# EasyEDA Pro project Final Main.eprj

# Schematic powermanagmen
Board Name: powermanagmen; Create Date: 2026-01-09; Page Name: powermanagmen; Project Name: Final Main; Schematic Name: powermanagmen; Update Date: 2026-01-09; File: powermanagmen; Id: /; Sheet: /
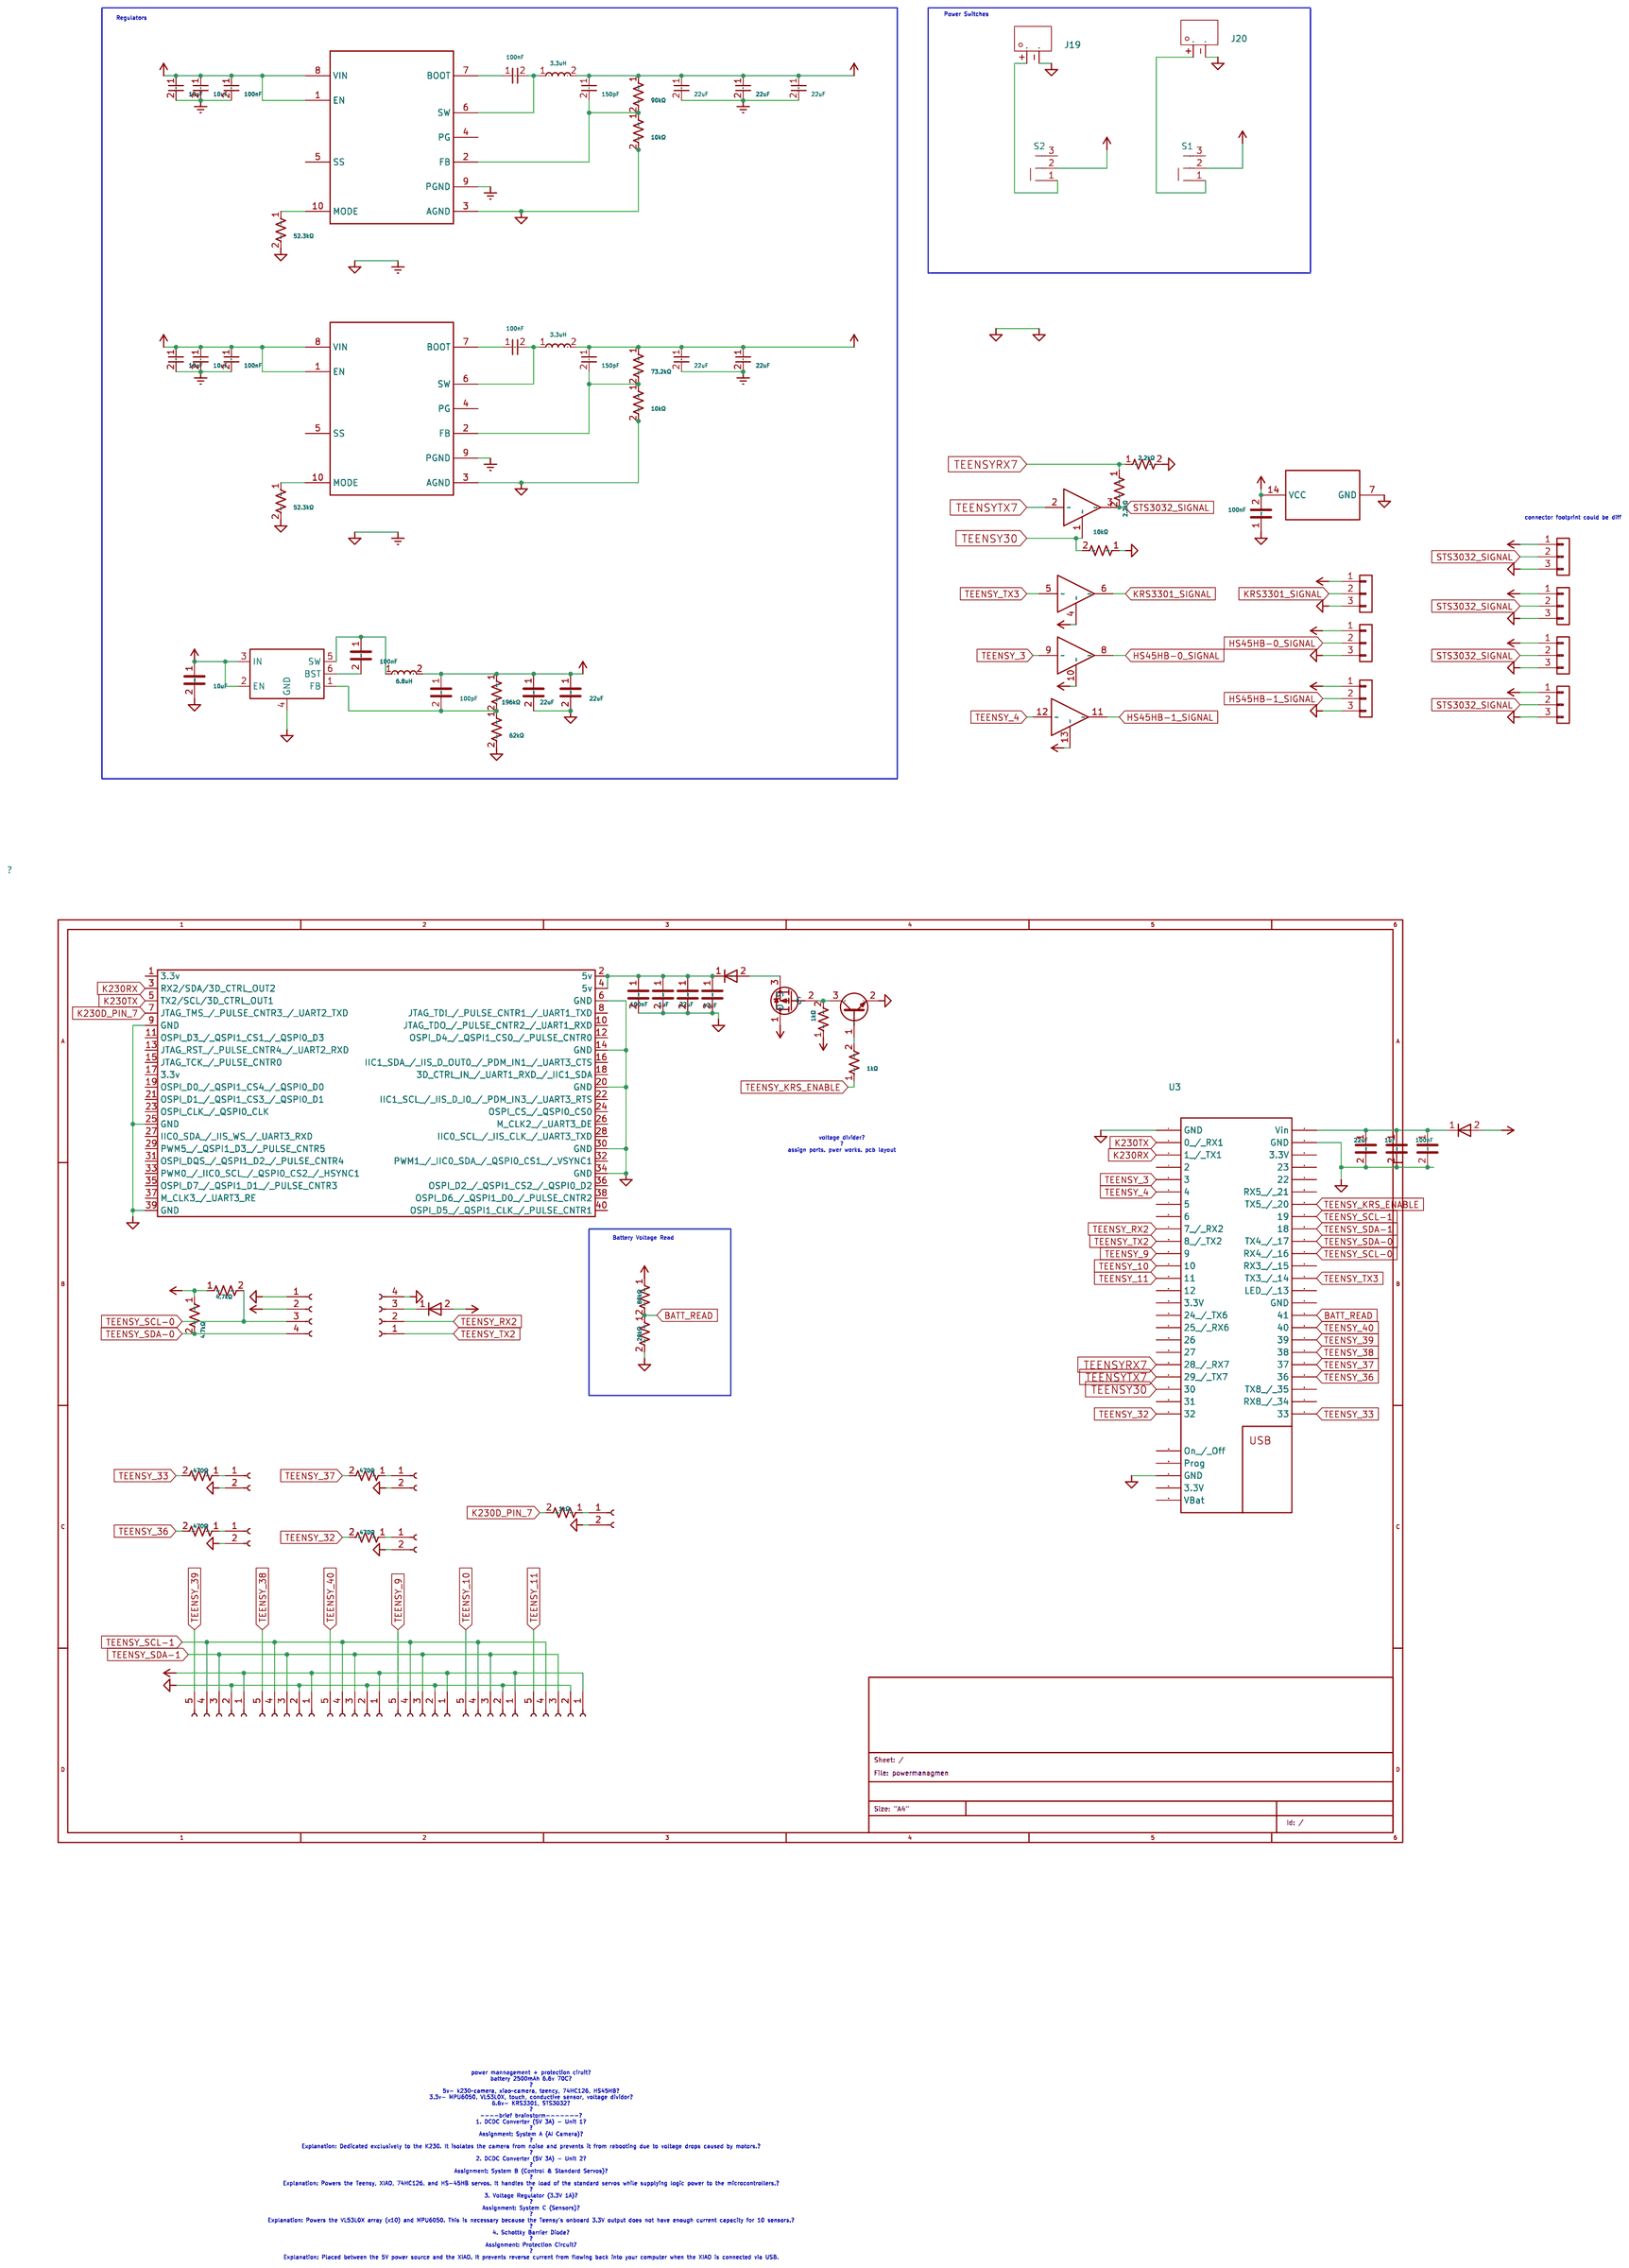
[diagram p0: schematic sheet]

## Parts
C1  100nF  [C0603]
C2  22uF  [C0603]
C3  1uF  [C0603]
C4  100nF  [C0603]
C5  10uF  [C0603]
C6  22uF  [C0603]
C7  22uF  [C0603]
C8  22uF  [C0603]
C10  100pF  [C0603]
C12  150pF  [C0603]
C17  100nF  [C0603]
C18  1uF  [C0603]
C19  22uF  [C0603]
C20  47uF  [C0603]
C21  22uF  [C0603]
C22  10uF  [C0603]
C23  100nF  [C0603]
C24  100nF  [C0603]
C28  100nF  [C0603]
C29  22uF  [C0603]
C31  10uF  [C0603]
C32  100nF  [C0603]
C33  100nF  [C0603]
C34  10uF  [C0603]
C35  10uF  [C0603]
C36  22uF  [C0603]
C37  22uF  [C0603]
C39  150pF  [C0603]
D1  BAT60B  [SOD-323_L1.7-W1.3-LS2.6-RD-1]
D2  BAT60B  [SOD-323_L1.7-W1.3-LS2.6-RD-1]
D3  BAT60B  [SOD-323_L1.7-W1.3-LS2.6-RD-1]
J1  B3B-XH-A(LF)(SN)  [CONN-TH_3P-P2.50_A2501WV2-3P]
J2  PZ254V-11-03P  [HDR-TH_3P-P2.54-V-M_PZ254V-11-03P]
J3  PZ254V-11-03P  [HDR-TH_3P-P2.54-V-M_PZ254V-11-03P]
J4  PZ254V-11-03P  [HDR-TH_3P-P2.54-V-M_PZ254V-11-03P]
J5  2.54-1*4P母  [HDR-TH_4P-P2.54-V-F]
J6  PZ254V-11-02P  [HDR-TH_2P-P2.54-V-M]
J7  PZ254V-11-02P  [HDR-TH_2P-P2.54-V-M]
J8  PZ254V-11-02P  [HDR-TH_2P-P2.54-V-M]
J9  PZ254V-11-02P  [HDR-TH_2P-P2.54-V-M]
J10  PZ254V-11-02P  [HDR-TH_2P-P2.54-V-M]
J12  B3B-XH-A(LF)(SN)  [CONN-TH_3P-P2.50_A2501WV2-3P]
J13  B3B-XH-A(LF)(SN)  [CONN-TH_3P-P2.50_A2501WV2-3P]
J14  B3B-XH-A(LF)(SN)  [CONN-TH_3P-P2.50_A2501WV2-3P]
J18  B5B-PH-K-S(LF)(SN)  [CONN-TH_B5B-PH-K-S-LF-SN]
J19  XT60-F  [CONN-TH_XT60PB-F]
J20  XT60-F  [CONN-TH_XT60PB-F]
J25  B5B-PH-K-S(LF)(SN)  [CONN-TH_B5B-PH-K-S-LF-SN]
J26  B5B-PH-K-S(LF)(SN)  [CONN-TH_B5B-PH-K-S-LF-SN]
J27  B5B-PH-K-S(LF)(SN)  [CONN-TH_B5B-PH-K-S-LF-SN]
J28  B5B-PH-K-S(LF)(SN)  [CONN-TH_B5B-PH-K-S-LF-SN]
J29  B5B-PH-K-S(LF)(SN)  [CONN-TH_B5B-PH-K-S-LF-SN]
J31  22035045  [CONN-TH_22035045]
L1  3.3uH  [IND-SMD_CYA0650-3.3UH]
L3  6.8uH  [L0805]
L4  3.3uH  [IND-SMD_CYA0650-3.3UH]
Q1  AO3401A  [SOT-23_L2.9-W1.3-P1.90-LS2.4-BR]
Q2  SS8050(RANGE:200-350)  [SOT-23-3_L2.9-W1.3-P1.90-LS2.4-BR]
R1  10kΩ  [R0603]
R2  4.7kΩ  [R0603]
R3  4.7kΩ  [R0603]
R4  470Ω  [R0603]
R5  470Ω  [R0603]
R6  470Ω  [R0603]
R7  470Ω  [R0603]
R8  1kΩ  [R0603]
R9  2.2kΩ  [R0603]
R10  2.2kΩ  [R0603]
R11  52.3kΩ  [R0603]
R12  196kΩ  [R0603]
R13  1kΩ  [R0603]
R14  1kΩ  [R0603]
R15  62kΩ  [R0603]
R20  90kΩ  [R1206]
R21  10kΩ  [R0603]
R22  80kΩ  [R0603]
R23  20kΩ  [R0603]
R24  52.3kΩ  [R0603]
R25  73.2kΩ  [R0603]
R26  10kΩ  [R0603]
S1  SS-12M11G4  [SW-TH_XKB_SS-12M11XX]
S2  SS-12M11G4  [SW-TH_XKB_SS-12M11XX]
U1  DM74LS126AM  [SOIC-14_L8.7-W3.9-P1.27-LS6.0-BL]  (sections 1,2,3,4,5)
U2  FH-00148  [HDR-SMD_40P-P2.54-V-F-R2-C20-S7.1-EH]
U3  TEENSY 4.1  [TEENSY 4.1]
U4  AP63201WU-7  [TSOT-23-6_L2.9-W1.6-P0.95-LS2.8-BR]
U5  TPS56A37RPAR  [VQFN-HR-10_L3.0-W3.0_TI_RPA]
U6  TPS56A37RPAR  [VQFN-HR-10_L3.0-W3.0_TI_RPA]

## Library data of the parts
C1 C4 C17 C23 C24 C28 C32 C33 = TCC0603X7R104K500CT: Capacitance:100nF Tolerance:±10% Tolerance:±10% Voltage Rating:50V Temperature Coefficient:X7R; LCSC Part Name: 100nF ±10% 50V; Supplier Part: C282519; Manufacturer: CCTC(三环); Supplier Footprint: 0603; JLCPCB Part Class: Extended Part; Datasheet: https://item.szlcsc.com/datasheet/TCC0603X7R104K500CT/268639.html; Supplier: LCSC; Tolerance: ±10%; Voltage Rating: 50V; Temperature Coefficient: X7R
C2 C6-C8 C19 C21 C29 C36 C37 = CL10A226MP8NUNE: Capacitance:22uF Tolerance:±20% Tolerance:±20% Voltage Rating:10V Temperature Coefficient:X5R; LCSC Part Name: 22uF ±20% 10V; Supplier Part: C86295; Manufacturer: SAMSUNG(三星); Supplier Footprint: 0603; JLCPCB Part Class: Extended Part; Datasheet: https://item.szlcsc.com/datasheet/CL10A226MP8NUNE/87471.html; Supplier: LCSC; Tolerance: ±20%; Voltage Rating: 10V; Temperature Coefficient: X5R
C3 C18 = CL10A105KB8NNNC: Capacitance:1uF Tolerance:±10% Tolerance:±10% Voltage Rating:50V Temperature Coefficient:X5R; LCSC Part Name: 1uF ±10% 50V; Supplier Part: C15849; Manufacturer: SAMSUNG(三星); Supplier Footprint: 0603; JLCPCB Part Class: Basic Part; Datasheet: https://item.szlcsc.com/datasheet/CL10A105KB8NNNC/16531.html; Supplier: LCSC; Tolerance: ±10%; Voltage Rating: 50V; Temperature Coefficient: X5R
C5 C22 C31 C34 C35 = CL10A106MO8NQNC: Capacitance:10uF Tolerance:±20% Tolerance:±20% Voltage Rating:16V Temperature Coefficient:X5R; LCSC Part Name: 10uF ±20% 16V; Supplier Part: C92487; Manufacturer: SAMSUNG(三星); Supplier Footprint: 0603; JLCPCB Part Class: Extended Part; Datasheet: https://item.szlcsc.com/datasheet/CL10A106MO8NQNC/93680.html; Supplier: LCSC; Tolerance: ±20%; Voltage Rating: 16V; Temperature Coefficient: X5R
C10 = CL10C101JB8NNNC: Capacitance:100pF Tolerance:±5% Tolerance:±5% Voltage Rating:50V Temperature Coefficient:C0G; LCSC Part Name: 100pF ±5% 50V; Supplier Part: C14858; Manufacturer: SAMSUNG(三星); Supplier Footprint: 0603; JLCPCB Part Class: Basic Part; Datasheet: https://item.szlcsc.com/datasheet/CL10C101JB8NNNC/15530.html; Supplier: LCSC; Tolerance: ±5%; Voltage Rating: 50V; Temperature Coefficient: C0G
C12 C39 = 0603B151K500NT: Capacitance:150pF Tolerance:±10% Tolerance:±10% Voltage Rating:50V Temperature Coefficient:X7R; LCSC Part Name: 150pF ±10% 50V; Supplier Part: C1594; Manufacturer: FH(风华); Supplier Footprint: 0603; JLCPCB Part Class: Basic Part; Datasheet: https://item.szlcsc.com/datasheet/0603B151K500NT/1946.html; Supplier: LCSC; Tolerance: ±10%; Voltage Rating: 50V; Temperature Coefficient: X7R
C20 = GRM188R60J476ME15D: Capacitance:47uF Tolerance:±20% Tolerance:±20% Voltage Rating:6.3V Temperature Coefficient:X5R; LCSC Part Name: 47uF ±20% 6.3V; Supplier Part: C140782; Manufacturer: muRata(村田); Supplier Footprint: 0603; JLCPCB Part Class: Extended Part; Datasheet: https://item.szlcsc.com/datasheet/GRM188R60J476ME15D/152108.html; Supplier: LCSC; Tolerance: ±20%; Voltage Rating: 6.3V; Temperature Coefficient: X5R
D1-D3 = BAT60B_C7502695: Diode Configuration:Independent Voltage - Forward(Vf@If):600mV@1A Voltage - DC Reverse(Vr):10V Current - Rectified:3A Reverse Leakage Current (Ir):25uA Non-Repetitive Peak Forward Surge Current:5A; LCSC Part Name: 电压:10V 电流:3A; Supplier Part: C7502695; Manufacturer: R+O(宏嘉诚); Supplier Footprint: SOD-323; JLCPCB Part Class: Extended Part; Datasheet: https://item.szlcsc.com/datasheet/BAT60B/8589412.html; Supplier: LCSC; Diode Configuration: Independent; Voltage - Forward(Vf@If): 600mV@1A; Voltage - DC Reverse(Vr): 10V; Current - Rectified: 3A; Reverse Leakage Current (Ir): 25uA; Non-Repetitive Peak Forward Surge Current: 5A
J1 J12-J14 = B3B-XH-A(LF)(SN): LCSC Part Name: 1x3P 间距:2.5mm 直插 系列:XH; Supplier Part: C144394; Manufacturer: JST; Supplier Footprint: 插件,P=2.5mm; JLCPCB Part Class: Extended Part; Datasheet: https://item.szlcsc.com/datasheet/B3B-XH-A(LF)(SN)/155726.html; Supplier: LCSC; Pins Structure: 1x3P; Pitch: 2.5mm; Mounting Type: Through Hole; Reference Series: XH; Number of Pins: 3P; Number of Rows: 1; Number of PINs Per Row: 3; Current Rating: 3A; Contact Material: Brass; Contact Plating: Tin; Operating Temperature: -25℃~+85℃; Voltage Rating: 250V; Plastic Material: PA66; Flame Retardant Rating: UL94V-0; Supplementary Features: K Pin; Color: White; Z-Height of the Board: 7mm; X-Length of Bottom Edge on Board (Spacing Line): 9.9mm; Y-Width of Bottom Edge on Board: 5.75mm
J2-J4 = PZ254V-11-03P: LCSC Part Name: 1x3P 间距:2.54mm 方针 直插; Supplier Part: C2937625; Manufacturer: XFCN(兴飞); Supplier Footprint: 插件,P=2.54mm; JLCPCB Part Class: Extended Part; Datasheet: https://item.szlcsc.com/datasheet/PZ254V-11-03P/3293280.html; Supplier: LCSC; Pin Structure: 1x3P; Pitch: 2.54mm; Circluar Pins/Square Pins: Pin Header; Mounting Type: Through Hole; Number of Rows: 1; Number of Pins: 3P; Current Rating: 3A; Voltage Rating (Max): 250V; Length of Mating Pin: 6mm; Insulation Height: 2.5mm; Length of End Connection Pin: 3mm; Operating Temperature: -40℃~+105℃; Color: Black
J5 = 2.54-1*4P母: Holes Structure:1x4P Pitch:2.54mm Row Spacing:- Circular Hole / Square Hole:Square Hole Mounting Type:Through Hole Number of Rows:1 Number of Positions:4P Current Rating:3A Voltage Rating (Max):- Holes Direction:Top Insulation Height:- Contact Material:Br; LCSC Part Name: 间距:2.54mm 1x4P 直插; Supplier Part: C2718488; Manufacturer: BOOMELE(博穆精密); Supplier Footprint: 插件,P=2.54mm; JLCPCB Part Class: Extended Part; Datasheet: https://item.szlcsc.com/datasheet/2.54-1*4P%25E6%25AF%258D/2834502.html; Supplier: LCSC; Holes Structure: 1x4P; Pitch: 2.54mm; Circular Hole / Square Hole: Square Hole; Mounting Type: Through Hole; Number of Rows: 1; Number of Positions: 4P; Current Rating: 3A; Holes Direction: Top; Contact Material: Bronze; Operating Temperature: -40℃~+105℃
J6-J10 = PZ254V-11-02P: Pin Structure:1x2P Pitch:2.54mm Row Spacing:- Circluar Pins/Square Pins:Pin Header Mounting Type:Through Hole Number of Rows:1 Number of Pins:2P Current Rating:- Voltage Rating (Max):- Length of Mating Pin:6mm Insulation Height:2.5mm Length of End Connect; LCSC Part Name: 1x2P 间距:2.54mm 方针 直插; Supplier Part: C492401; Manufacturer: XFCN(兴飞); Supplier Footprint: 插件,P=2.54mm; JLCPCB Part Class: Extended Part; Datasheet: https://item.szlcsc.com/datasheet/PZ254V-11-02P/502957.html; Supplier: LCSC; Pin Structure: 1x2P; Pitch: 2.54mm; Circluar Pins/Square Pins: Pin Header; Mounting Type: Through Hole; Number of Rows: 1; Number of Pins: 2P; Length of Mating Pin: 6mm; Insulation Height: 2.5mm; Length of End Connection Pin: 3mm; Contact Material: Brass; Operating Temperature: -40℃~+105℃; Color: Black
J18 J25-J29 = B5B-PH-K-S(LF)(SN): Pins Structure:1x5P Pitch:2mm Mounting Type:Through Hole Reference Series:PH Number of Pins:5P Number of Rows:1 Number of PINs Per Row:5 Row Spacing:- Current Rating:2A Contact Material:Brass Contact Plating:Tin Operating Temperature:-25℃~+85℃ Operating T; LCSC Part Name: 1x5P 间距:2mm 直插 系列:PH; Supplier Part: C157993; Manufacturer: JST; Supplier Footprint: 插件,P=2mm; JLCPCB Part Class: Extended Part; Datasheet: https://item.szlcsc.com/datasheet/B5B-PH-K-S(LF)(SN)/169341.html; Supplier: LCSC; Pins Structure: 1x5P; Pitch: 2mm; Mounting Type: Through Hole; Reference Series: PH; Number of Pins: 5P; Number of Rows: 1; Number of PINs Per Row: 5; Current Rating: 2A; Contact Material: Brass; Contact Plating: Tin; Operating Temperature: -25℃~+85℃; Voltage Rating: 100V; Plastic Material: PA66; Flame Retardant Rating: UL94V-0; Supplementary Features: K Pin; Color: White; Z-Height of the Board: 6mm; X-Length of Bottom Edge on Board (Spacing Line): 11.9mm; Y-Width of Bottom Edge on Board: 4.5mm
J19 J20 = XT60-F: LCSC Part Name: AMASS(艾迈斯)XT60模型插头 3.5mm镀金香蕉头母头 XT60-F; Supplier Part: C98734; Manufacturer: AMASS(艾迈斯); JLCPCB Part Class: Extended Part; Datasheet: https://item.szlcsc.com/datasheet/XT60-F/99944.html; Supplier: LCSC; Type: Banana Connector; Colour: Yellow; InterfaceType: Female; MetalMaterial: Gold Plated
J31 = 22035045: Pins Structure:1x4P Pitch:2.5mm Mounting Type:Through Hole Reference Series:Mini-SPOX(5264) Number of Pins:4P Number of Rows:1 Number of PINs Per Row:4 Row Spacing:- Current Rating:3A Contact Material:Brass Contact Plating:Tin Operating Temperature:-55℃~+; LCSC Part Name: 1x4P 间距:2.5mm 直插 系列:Mini-SPOX(5264); Supplier Part: C185198; Manufacturer: MOLEX; Supplier Footprint: 插件,P=2.5mm; JLCPCB Part Class: Extended Part; Datasheet: https://www.molex.com/content/dam/molex/molex-dot-com/products/automated/en-us/salesdrawingpdf/526/5267/022035045_sd.pdf?inline\; Supplier: LCSC; Pins Structure: 1x4P; Pitch: 2.5mm; Mounting Type: Through Hole; Reference Series: Mini-SPOX(5264); Number of Pins: 4P; Number of Rows: 1; Number of PINs Per Row: 4; Current Rating: 3A; Contact Material: Brass; Contact Plating: Tin; Operating Temperature: -55℃~+105℃; Voltage Rating: 250V; Plastic Material: PA; Flame Retardant Rating: UL94V-0; Color: White; Z-Height of the Board: 5.9mm; X-Length of Bottom Edge on Board (Spacing Line): 12.4mm; Y-Width of Bottom Edge on Board: 4.9mm
L1 L4 = CYA0650-3.3UH: Inductance: Tolerance:±20% Tolerance:±20% Current Rating: DC Resistance(DCR):19.9mΩ; LCSC Part Name: 3.3uH ±20%; Supplier Part: C5189753; Manufacturer: SHOU HAN(首韩); Supplier Footprint: SMD,7.2x6.6mm; JLCPCB Part Class: Extended Part; Datasheet: https://atta.szlcsc.com/upload/public/pdf/source/20250110/D8E5DDB17316764D39629F3242DE5FE2.pdf; Supplier: LCSC; Tolerance: ±20%; DC Resistance(DCR): 19.9mΩ
L3 = MGFL2012F6R8MT-LF: Inductance:6.8uH Tolerance:±20% Tolerance:±20% Current Rating:550mA Current - Saturation (Isat):- DC Resistance(DCR):270mΩ Q @ Frequency:- Frequency - Self Resonant:- Ratings:-; LCSC Part Name: 6.8uH ±20%; Supplier Part: C486332; Manufacturer: microgate(麦捷科技); Supplier Footprint: 0805; JLCPCB Part Class: Extended Part; Datasheet: https://item.szlcsc.com/datasheet/MGFL2012F6R8MT-LF/494805.html; Supplier: LCSC; Tolerance: ±20%; Current Rating: 550mA; DC Resistance(DCR): 270mΩ
Q1 = AO3401A_C347476: Number:1 P-Channel Drain to Source Voltage:30V Current - Continuous Drain(Id):4.2A RDS(on):50mΩ@10V Pd - Power Dissipation:1.4W Gate Threshold Voltage (Vgs(th)):1.3V@250uA Gate Charge(Qg):9.4nC@4.5V Input Capacitance(Ciss):954pF Reverse Transfer Capacitan; LCSC Part Name: 1个P沟道 耐压:30V 电流:4.2A; Supplier Part: C347476; Manufacturer: UMW(友台半导体); Supplier Footprint: SOT-23; JLCPCB Part Class: Extended Part; Datasheet: https://item.szlcsc.com/datasheet/AO3401A/324136.html; Supplier: LCSC; Number: 1 P-Channel; Drain to Source Voltage: 30V; Current - Continuous Drain(Id): 4.2A; RDS(on): 50mΩ@10V; Pd - Power Dissipation: 1.4W; Gate Threshold Voltage (Vgs(th)): 1.3V@250uA; Gate Charge(Qg): 9.4nC@4.5V; Input Capacitance(Ciss): 954pF; Reverse Transfer Capacitance (Crss@Vds): 77pF; Operating Temperature: -55℃~+150℃; Type: P-Channel; Output Capacitance(Coss): 115pF
Q2 = SS8050(RANGE:200-350)_C2150: type:NPN Current - Collector(Ic):1.5A Collector - Emitter Voltage VCEO:25V Pd - Power Dissipation:300mW DC Current Gain:200@800mA,1V DC Current Gain:200@800mA,1V Transition frequency(fT):100MHz Current - Collector Cutoff:100nA Vce Saturation(VCE(sat)):500; LCSC Part Name: hfe=200~350 NPN 电流:1.5A 电压:25V; Supplier Part: C2150; Manufacturer: CJ(江苏长电/长晶); Supplier Footprint: SOT-23; JLCPCB Part Class: Basic Part; Datasheet: https://item.szlcsc.com/datasheet/SS8050(RANGE%253A200-350)/2507.html; Supplier: LCSC; type: NPN; Current - Collector(Ic): 1.5A; Collector - Emitter Voltage VCEO: 25V; Pd - Power Dissipation: 300mW; DC Current Gain: 200@800mA,1V; Transition frequency(fT): 100MHz; Current - Collector Cutoff: 100nA; Vce Saturation(VCE(sat)): 500mV@800mA,80mA; Operating Temperature: -55℃~+150℃; Emitter-Base Voltage(Vebo): 5V; Number: 1 NPN
R1 R21 R26 = 0603WAF1002T5E: Type:Thick Film Resistor Resistance:10kΩ Tolerance:±1% Tolerance:±1% Power(Watts):100mW Voltage-Supply(Max):75V Temperature Coefficient:±100ppm/℃ Temperature Coefficient:±100ppm/℃ Operating Temperature:-55℃~+155℃ Operating Temperature:-55℃~+155℃; LCSC Part Name: 厚膜电阻 10kΩ ±1% 100mW; Supplier Part: C25804; Manufacturer: UNI-ROYAL(厚声); Supplier Footprint: 0603; JLCPCB Part Class: Basic Part; Datasheet: https://item.szlcsc.com/datasheet/0603WAF1002T5E/26547.html; Supplier: LCSC; Type: Thick Film Resistor; Tolerance: ±1%; Power(Watts): 100mW; Voltage-Supply(Max): 75V; Temperature Coefficient: ±100ppm/℃; Operating Temperature: -55℃~+155℃
R2 R3 = FRC0603F4701TS: Type:Thick Film Resistor Resistance:4.7kΩ Tolerance:±1% Tolerance:±1% Power(Watts):100mW Voltage-Supply(Max):75V Temperature Coefficient:±100ppm/℃ Temperature Coefficient:±100ppm/℃ Operating Temperature:-55℃~+155℃ Operating Temperature:-55℃~+155℃; LCSC Part Name: 4.7kΩ ±1% 100mW 厚膜电阻; Supplier Part: C2907034; Manufacturer: FOJAN(富捷); Supplier Footprint: 0603; JLCPCB Part Class: Extended Part; Supplier: LCSC; Type: Thick Film Resistor; Tolerance: ±1%; Power(Watts): 100mW; Voltage-Supply(Max): 75V; Temperature Coefficient: ±100ppm/℃; Operating Temperature: -55℃~+155℃
R4-R7 = 0603WAF4700T5E: Type:Thick Film Resistor Resistance:470Ω Tolerance:±1% Tolerance:±1% Power(Watts):100mW Voltage-Supply(Max):75V Temperature Coefficient:±100ppm/℃ Temperature Coefficient:±100ppm/℃ Operating Temperature:-55℃~+155℃ Operating Temperature:-55℃~+155℃; LCSC Part Name: 470Ω ±1% 100mW 厚膜电阻; Supplier Part: C23179; Manufacturer: UNI-ROYAL(厚声); Supplier Footprint: 0603; JLCPCB Part Class: Basic Part; Datasheet: https://item.szlcsc.com/datasheet/0603WAF4700T5E/23906.html; Supplier: LCSC; Type: Thick Film Resistor; Tolerance: ±1%; Power(Watts): 100mW; Voltage-Supply(Max): 75V; Temperature Coefficient: ±100ppm/℃; Operating Temperature: -55℃~+155℃
R8 R13 R14 = 0603WAF1001T5E: Type:Thick Film Resistor Resistance:1kΩ Tolerance:±1% Tolerance:±1% Power(Watts):100mW Voltage-Supply(Max):75V Temperature Coefficient:±100ppm/℃ Temperature Coefficient:±100ppm/℃ Operating Temperature:-55℃~+155℃ Operating Temperature:-55℃~+155℃; LCSC Part Name: 1kΩ ±1% 100mW 厚膜电阻; Supplier Part: C21190; Manufacturer: UNI-ROYAL(厚声); Supplier Footprint: 0603; JLCPCB Part Class: Basic Part; Datasheet: https://item.szlcsc.com/datasheet/0603WAF1001T5E/21904.html; Supplier: LCSC; Type: Thick Film Resistor; Tolerance: ±1%; Power(Watts): 100mW; Voltage-Supply(Max): 75V; Temperature Coefficient: ±100ppm/℃; Operating Temperature: -55℃~+155℃
R9 R10 = 0603WAF2201T5E_C4190: Type:Thick Film Resistors Resistance:2.2kΩ Tolerance:±1% Tolerance:±1% Power(Watts): Overload Voltage (Max): Temperature Coefficient:±100ppm/℃ Temperature Coefficient:±100ppm/℃ Operating Temperature Range:-55℃~+155℃ Operating Temperature Range:-55℃~+155℃; LCSC Part Name: 2.2kΩ ±1% 100mW 厚膜电阻; Supplier Part: C4190; Manufacturer: UNI-ROYAL(厚声); Manufacturer Part: 0603WAF2201T5E; Supplier Footprint: 0603; JLCPCB Part Class: Basic Part; Datasheet: https://atta.szlcsc.com/upload/public/pdf/source/20200306/C422600_1E6D84923E4A46A82E41ADD87F860B5C.pdf; Supplier: LCSC; Type: Thick Film Resistors; Tolerance: ±1%; Temperature Coefficient: ±100ppm/℃; Operating Temperature Range: -55℃~+155℃
R11 R24 = FRC0603F5232TS: Type:Thick Film Resistor Resistance:52.3kΩ Tolerance:±1% Tolerance:±1% Power(Watts):100mW Voltage-Supply(Max):75V Temperature Coefficient:±100ppm/℃ Temperature Coefficient:±100ppm/℃ Operating Temperature:-55℃~+155℃ Operating Temperature:-55℃~+155℃; LCSC Part Name: 52.3kΩ ±1% 100mW 厚膜电阻; Supplier Part: C2933235; Manufacturer: FOJAN(富捷); Supplier Footprint: 0603; JLCPCB Part Class: Extended Part; Supplier: LCSC; Type: Thick Film Resistor; Tolerance: ±1%; Power(Watts): 100mW; Voltage-Supply(Max): 75V; Temperature Coefficient: ±100ppm/℃; Operating Temperature: -55℃~+155℃
R12 = FRC0603F1963TS: Type:Thick Film Resistor Resistance:196kΩ Tolerance:±1% Tolerance:±1% Power(Watts):100mW Voltage-Supply(Max):75V Temperature Coefficient:±100ppm/℃ Temperature Coefficient:±100ppm/℃ Operating Temperature:-55℃~+155℃ Operating Temperature:-55℃~+155℃; LCSC Part Name: 196kΩ ±1% 100mW 厚膜电阻; Supplier Part: C2974032; Manufacturer: FOJAN(富捷); Supplier Footprint: 0603; JLCPCB Part Class: Extended Part; Supplier: LCSC; Type: Thick Film Resistor; Tolerance: ±1%; Power(Watts): 100mW; Voltage-Supply(Max): 75V; Temperature Coefficient: ±100ppm/℃; Operating Temperature: -55℃~+155℃
R15 = FRC0603F6202TS: Type:Thick Film Resistor Resistance:62kΩ Tolerance:±1% Tolerance:±1% Power(Watts):100mW Voltage-Supply(Max):75V Temperature Coefficient:±100ppm/℃ Temperature Coefficient:±100ppm/℃ Operating Temperature:-55℃~+155℃ Operating Temperature:-55℃~+155℃; LCSC Part Name: 62kΩ ±1% 100mW 厚膜电阻; Supplier Part: C2907059; Manufacturer: FOJAN(富捷); Supplier Footprint: 0603; JLCPCB Part Class: Extended Part; Supplier: LCSC; Type: Thick Film Resistor; Tolerance: ±1%; Power(Watts): 100mW; Voltage-Supply(Max): 75V; Temperature Coefficient: ±100ppm/℃; Operating Temperature: -55℃~+155℃
R20 = RT1206DRE0790KL: Type:Thin Film Resistor Resistance:90kΩ Tolerance:±0.5% Tolerance:±0.5% Power(Watts):250mW Voltage-Supply(Max):200V Temperature Coefficient:±50ppm/℃ Temperature Coefficient:±50ppm/℃ Operating Temperature:-55℃~+155℃ Operating Temperature:-55℃~+155℃; LCSC Part Name: 薄膜电阻 90kΩ ±0.5% 250mW; Supplier Part: C862072; Manufacturer: YAGEO(国巨); Supplier Footprint: 1206; JLCPCB Part Class: Extended Part; Datasheet: https://item.szlcsc.com/datasheet/RT1206DRE0790KL/932439.html; Supplier: LCSC; Type: Thin Film Resistor; Tolerance: ±0.5%; Power(Watts): 250mW; Voltage-Supply(Max): 200V; Temperature Coefficient: ±50ppm/℃; Operating Temperature: -55℃~+155℃
R22 = ARG03FTC8002N: Type:Thin Film Resistor Resistance:80kΩ Tolerance:±1% Tolerance:±1% Power(Watts):100mW Voltage-Supply(Max):75V Temperature Coefficient:±25ppm/℃ Temperature Coefficient:±25ppm/℃ Operating Temperature:-55℃~+155℃ Operating Temperature:-55℃~+155℃; LCSC Part Name: 薄膜电阻 80kΩ ±1% 100mW 停产; Supplier Part: C3014409; Manufacturer: Viking(光颉); Supplier Footprint: 0603; JLCPCB Part Class: Extended Part; Datasheet: https://item.szlcsc.com/datasheet/ARG03FTC8002N/3525166.html; Supplier: LCSC; Type: Thin Film Resistor; Tolerance: ±1%; Power(Watts): 100mW; Voltage-Supply(Max): 75V; Temperature Coefficient: ±25ppm/℃; Operating Temperature: -55℃~+155℃
R23 = FRC0603F2002TS: Type:Thick Film Resistor Resistance:20kΩ Tolerance:±1% Tolerance:±1% Power(Watts):100mW Voltage-Supply(Max):75V Temperature Coefficient:±100ppm/℃ Temperature Coefficient:±100ppm/℃ Operating Temperature:-55℃~+155℃ Operating Temperature:-55℃~+155℃; LCSC Part Name: 20kΩ ±1% 100mW 厚膜电阻; Supplier Part: C2907011; Manufacturer: FOJAN(富捷); Supplier Footprint: 0603; JLCPCB Part Class: Extended Part; Supplier: LCSC; Type: Thick Film Resistor; Tolerance: ±1%; Power(Watts): 100mW; Voltage-Supply(Max): 75V; Temperature Coefficient: ±100ppm/℃; Operating Temperature: -55℃~+155℃
R25 = FRC0603F7322TS: Type:Thick Film Resistor Resistance:73.2kΩ Tolerance:±1% Tolerance:±1% Power(Watts):100mW Voltage-Supply(Max):75V Temperature Coefficient:±100ppm/℃ Temperature Coefficient:±100ppm/℃ Operating Temperature:-55℃~+155℃ Operating Temperature:-55℃~+155℃; LCSC Part Name: 73.2kΩ ±1% 100mW 厚膜电阻; Supplier Part: C2933257; Manufacturer: FOJAN(富捷); Supplier Footprint: 0603; JLCPCB Part Class: Extended Part; Supplier: LCSC; Type: Thick Film Resistor; Tolerance: ±1%; Power(Watts): 100mW; Voltage-Supply(Max): 75V; Temperature Coefficient: ±100ppm/℃; Operating Temperature: -55℃~+155℃
S1 S2 = SS-12M11G4: Circuit:SPDT Actuator Style:Rectangular Columnar Termination Style:PC Pin Length:13mm Width:7.2mm Switch Height:6.6mm Mounting Type:Through Hole Actuator Color:Black Current Rating:6A Voltage Rating:120V Life:10,000 Cycles Operating Temperature:-40℃~+85℃; LCSC Part Name: 柄长4mm 直插双档 滑动开关; Supplier Part: C2879840; Manufacturer: XKB Connection(中国星坤); Supplier Footprint: 插件,13x7.2mm; JLCPCB Part Class: Extended Part; Datasheet: https://item.szlcsc.com/datasheet/SS-12M11G4/3089136.html; Supplier: LCSC; Circuit: SPDT; Actuator Style: Rectangular Columnar; Termination Style: PC Pin; Length: 13mm; Width: 7.2mm; Switch Height: 6.6mm; Mounting Type: Through Hole; Actuator Color: Black; Current Rating: 6A; Voltage Rating: 120V; Life: 10,000 Cycles; Operating Temperature: -40℃~+85℃
U1 = DM74LS126AM: Supplier Part: C3753706; Manufacturer: onsemi(安森美); Supplier Footprint: SOIC-14; JLCPCB Part Class: Extended Part; Datasheet: https://item.szlcsc.com/datasheet/DM74LS126AM/4321233.html; Supplier: LCSC; Voltage - Supply: 4.75V~5.25V; Number of Elements: 4; Number of Bits per Element: 1; Current - Output Low(IOL): 24mA; Current - Output High(IOH): 2.6mA; Logic Family: 74LS; Operating Temperature: 0℃~+70℃
U2 = FH-00148: Holes Structure:2x20P Pitch:2.54mm Row Spacing:2.54mm Circular Hole / Square Hole:Square Hole Mounting Type:Surface Mount,Vertical Number of Rows:2 Number of Positions:40P Current Rating:3A Voltage Rating (Max):- Holes Direction:Top Insulation Height:7.1m; LCSC Part Name: 间距:2.54mm 2x20P 立贴; Supplier Part: C2685092; Manufacturer: Liansheng(连盛); Supplier Footprint: SMD,P=2.54mm; JLCPCB Part Class: Extended Part; Datasheet: https://item.szlcsc.com/datasheet/FH-00148/2784366.html; Supplier: LCSC; Holes Structure: 2x20P; Pitch: 2.54mm; Row Spacing: 2.54mm; Circular Hole / Square Hole: Square Hole; Mounting Type: Surface Mount,Vertical; Number of Rows: 2; Number of Positions: 40P; Current Rating: 3A; Holes Direction: Top; Insulation Height: 7.1mm; Contact Material: Brass; Contact Plating: Gold; Operating Temperature: -40℃~+105℃
U3 = TEENSY 4.1
U4 = AP63201WU-7: LCSC Part Name: 3.8V至32V输入、2A低静态电流同步降压转换器，增强EMI抑制; Supplier Part: C2071044; Manufacturer: DIODES(美台); Supplier Footprint: TSOT-23-6; JLCPCB Part Class: Extended Part; Datasheet: https://item.szlcsc.com/datasheet/AP63201WU-7/2162627.html; Supplier: LCSC; Function: Buck; Voltage - Supply: 3.8V~32V; Output Current: 2A; Frequency - Switching: 500kHz; Operating Temperature: -40℃~+85℃; Synchronous Rectifier: Yes; Number of Outputs: 1; Topology: Buck; Quiescent Current: 22uA; Switch tube (built-in/external): Built-In; Output Type: Adjustable
U5 U6 = TPS56A37RPAR: Supplier Part: C22392669; Manufacturer: TI(德州仪器); Supplier Footprint: VQFN-HR-10(3x3); JLCPCB Part Class: Extended Part; Datasheet: https://www.ti.com.cn/cn/lit/ds/symlink/tps56a37.pdf?ts=1739433904040&ref_url=https%253A%252F%252Fwww.ti.com.cn%252Fsitesearch%252Fzh-cn%252Fdocs%252Funiversalsearch.tsp%253FlangPref%253Dzh-CN%2526nr%253D12%2526searchTerm%253DTPS56A37RPAR; Supplier: LCSC; Voltage - Supply: 4.5V~28V; Output Current: 10A; Frequency - Switching: 500kHz; Operating Temperature: -40℃~+150℃@(TJ); Number of Outputs: 1; Switch tube (built-in/external): Built-in

## Nets
+3.3V: C10.1 C21.1 C29.1 J18.1(Pin) J25.1(Pin) J26.1(Pin) J27.1(Pin) J28.1(Pin) J29.1(Pin) L3.2 R2.1 R3.1 R12.1
+5V: C1.2 C36.1 C37.1 C39.1 D1.2(A) D3.2(A) L4.2 Q1.1(D) R13.1 R25.1 U1.4 U1.10 U1.13 U1.14(VCC)
+6V: C6.1 C7.1 C8.1 C12.1 J1.1(Pin) J3.1(Pin) J4.1(Pin) J12.1(Pin) J13.1(Pin) J14.1(Pin) L1.2 R20.1
AGND: R24.2 R26.2 U6.3(AGND)
AGND1: R11.2 R21.2 U5.3(AGND)
+BATT: C5.1 C22.1 C24.1 C31.1 C33.1 C34.1 C35.1 J2.1(Pin) R22.1 S1.2 S2.2 U4.2(EN) U4.3(IN) U5.1(EN) U5.8(VIN) U6.1(EN) U6.8(VIN)
BATT_READ: R22.2 R23.1 U3.40(41)
HS45HB-0_SIGNAL: J3.2(Pin) U1.8
HS45HB-1_SIGNAL: J4.2(Pin) U1.11
K230D_PIN_7: R8.2 U2.7(JTAG_TMS_/_PULSE_CNTR3_/_UART2_TXD)
K230RX: U2.3(RX2/SDA/3D_CTRL_OUT2) U3.3(1 / TX1)
K230TX: U2.5(TX2/SCL/3D_CTRL_OUT1) U3.2(0 / RX1)
KRS3301_SIGNAL: J2.2(Pin) U1.6
MGND: C5.2 C6.2 C7.2 C8.2 C22.2 C24.2 J19.-(2) U5.9(PGND)
POWER_+3.3V: J5.2(Pin)
POWER_GND: C1.1 C2.2 C3.2 C4.2 C17.2 C18.2 C19.2 C20.2 C21.2 C29.2 C31.2 C33.2 C34.2 C35.2 C36.2 C37.2 J1.3(Pin) J2.3(Pin) J3.3(Pin) J4.3(Pin) J5.1(Pin) J6.2(Pin) J7.2(Pin) J8.2(Pin) J9.2(Pin) J10.2(Pin) J12.3(Pin) J13.3(Pin) J14.3(Pin) J18.2(Pin) J20.-(2) J25.2(Pin) J26.2(Pin) J27.2(Pin) J28.2(Pin) J29.2(Pin) J31.4(Pin) Q2.2(E) R1.1 R10.2 R15.2 R23.2 U1.7(GND) U2.6(GND) U2.9(GND) U2.14(GND) U2.20(GND) U2.25(GND) U2.30(GND) U2.34(GND) U2.39(GND) U3.1(GND) U3.26(GND) U3.51(GND) U4.4(GND) U6.9(PGND)
STS3032_SIGNAL: J1.2(Pin) J12.2(Pin) J13.2(Pin) J14.2(Pin) R9.2 U1.3
TEENSY30: R1.2 U1.1 U3.22(30)
TEENSY_3: U1.9 U3.5(3)
TEENSY_4: U1.12 U3.6(4)
TEENSY_9: J27.5(Pin) U3.11(9)
TEENSY_10: J28.5(Pin) U3.12(10)
TEENSY_11: J29.5(Pin) U3.13(11)
TEENSY_32: R7.2 U3.24(32)
TEENSY_33: R4.2 U3.48(33)
TEENSY_36: R5.2 U3.45(36)
TEENSY_37: R6.2 U3.44(37)
TEENSY_38: J18.5(Pin) U3.43(38)
TEENSY_39: J25.5(Pin) U3.42(39)
TEENSY_40: J26.5(Pin) U3.41(40)
TEENSY_KRS_ENABLE: R14.1 U3.31(TX5 / 20)
TEENSY_RX2: J31.2(Pin) U3.9(7 / RX2)
TEENSY_SCL-0: J5.3(Pin) R3.2 U3.35(RX4 / 16)
TEENSY_SCL-1: J18.4(Pin) J25.4(Pin) J26.4(Pin) J27.4(Pin) J28.4(Pin) J29.4(Pin) U3.32(19)
TEENSY_SDA-0: J5.4(Pin) R2.2 U3.34(TX4 / 17)
TEENSY_SDA-1: J18.3(Pin) J25.3(Pin) J26.3(Pin) J27.3(Pin) J28.3(Pin) J29.3(Pin) U3.33(18)
TEENSY_TX2: J31.1(Pin) U3.10(8 / TX2)
TEENSY_TX3: U1.5 U3.37(TX3 / 14)
TEENSYRX7: R9.1 R10.1 U3.20(28 / RX7)
TEENSYTX7: U1.2 U3.21(29 / TX7)
$1N12: C10.2 R12.2 R15.1 U4.1(FB)
$1N18: J20.+(1) S1.1
$1N25: C28.2 L1.1 U5.6(SW)
$1N29: C23.1 L3.1 U4.5(SW)
$1N32: R11.1 U5.10(MODE)
$1N56: C28.1 U5.7(BOOT)
$1N84: C12.2 R20.2 R21.1 U5.2(FB)
$1N113: C23.2 U4.6(BST)
$1N12525: C2.1 C3.1 C4.1 D1.1(K) U3.25(Vin)
$1N12541: C17.1 C18.1 C19.1 C20.1 D2.1(K) U2.2(5v) U2.4(5v)
$1N12578: Q2.1(B) R14.2
$1N12583: Q1.2(G) Q2.3(C) R13.2
$1N12598: J10.1(Pin) R8.1
$1N12604: J8.1(Pin) R6.1
$1N12618: J6.1(Pin) R4.1
$1N12632: J9.1(Pin) R7.1
$1N12638: J7.1(Pin) R5.1
$1N12659: D3.1(K) J31.3(Pin)
$1N12737: D2.2(A) Q1.3(S)
$1N14648: J19.+(1) S2.1
$1N16477: C32.2 L4.1 U6.6(SW)
$1N16482: R24.1 U6.10(MODE)
$1N16489: C32.1 U6.7(BOOT)
$1N16497: C39.2 R25.2 R26.1 U6.2(FB)

Not connected (* = marked no-connect by the designer): S1 3; S2 3; U2 1(3.3v) 8(JTAG_TDI_/_PULSE_CNTR1_/_UART1_TXD) 10(JTAG_TDO_/_PULSE_CNTR2_/_UART1_RXD) 11(OSPI_D3_/_QSPI1_CS1_/_QSPI0_D3) 12(OSPI_D4_/_QSPI1_CS0_/_PULSE_CNTR0) 13(JTAG_RST_/_PULSE_CNTR4_/_UART2_RXD) 15(JTAG_TCK_/_PULSE_CNTR0) 16(IIC1_SDA_/_IIS_D_OUT0_/_PDM_IN1_/_UART3_CTS) 17(3.3v) 18(3D_CTRL_IN_/_UART1_RXD_/_IIC1_SDA) 19(OSPI_D0_/_QSPI1_CS4_/_QSPI0_D0) 21(OSPI_D1_/_QSPI1_CS3_/_QSPI0_D1) 22(IIC1_SCL_/_IIS_D_I0_/_PDM_IN3_/_UART3_RTS) 23(OSPI_CLK_/_QSPI0_CLK) 24(OSPI_CS_/_QSPI0_CS0) 26(M_CLK2_/_UART3_DE) 27(IIC0_SDA_/_IIS_WS_/_UART3_RXD) 28(IIC0_SCL_/_IIS_CLK_/_UART3_TXD) 29(PWM5_/_QSPI1_D3_/_PULSE_CNTR5) 31(OSPI_DQS_/_QSPI1_D2_/_PULSE_CNTR4) 32(PWM1_/_IIC0_SDA_/_QSPI0_CS1_/_VSYNC1) 33(PWM0_/_IIC0_SCL_/_QSPI0_CS2_/_HSYNC1) 35(OSPI_D7_/_QSPI1_D1_/_PULSE_CNTR3) 36(OSPI_D2_/_QSPI1_CS2_/_QSPI0_D2) 37(M_CLK3_/_UART3_RE) 38(OSPI_D6_/_QSPI1_D0_/_PULSE_CNTR2) 40(OSPI_D5_/_QSPI1_CLK_/_PULSE_CNTR1); U3 4(2) 7(5) 8(6) 14(12) 15(3.3V) 16(24 / TX6) 17(25 / RX6) 18(26) 19(27) 23(31) 27(3.3V) 28(23) 29(22) 30(RX5 / 21) 36(RX3 / 15) 38(LED / 13) 39(GND) 46(TX8 / 35) 47(RX8 / 34) 49(On / Off) 50(Prog) 52(3.3V) 53(VBat); U5 4(PG) 5(SS); U6 4(PG) 5(SS)

## Notes on the sheet
- Regulators
- Power Switches
- connector footprint could be diff
- voltage divider
  assign ports. pwer works. pcb layout
- Battery Voltage Read
- power mannagement + protection ciruit
  battery 2500mAh 6.6v 70C
  5v- k230~camera, xiao~camera, teency, 74HC126, HS45HB
  3.3v- MPU6050, VL53L0X, touch, conductive sensor, voltage dividor
  6.6v- KRS3301, STS3032
  ----brief brainstorm-------
  1. DCDC Converter (5V 3A) - Unit 1
  Assignment: System A (AI Camera)
  Explanation: Dedicated exclusively to the K230. It isolates the camera from noise and prevents it from rebooting due to voltage drops caused by motors.
  2. DCDC Converter (5V 3A) - Unit 2
  Assignment: System B (Control & Standard Servos)
  Explanation: Powers the Teensy, XIAO, 74HC126, and HS-45HB servos. It handles the load of the standard servos while supplying logic power to the microcontrollers.
  3. Voltage Regulator (3.3V 1A)
  Assignment: System C (Sensors)
  Explanation: Powers the VL53L0X array (x10) and MPU6050. This is necessary because the Teensy's onboard 3.3V output does not have enough current capacity for 10 sensors.
  4. Schottky Barrier Diode
  Assignment: Protection Circuit
  Explanation: Placed between the 5V power source and the XIAO. It prevents reverse current from flowing back into your computer when the XIAO is connected via USB.

# Board PCB2
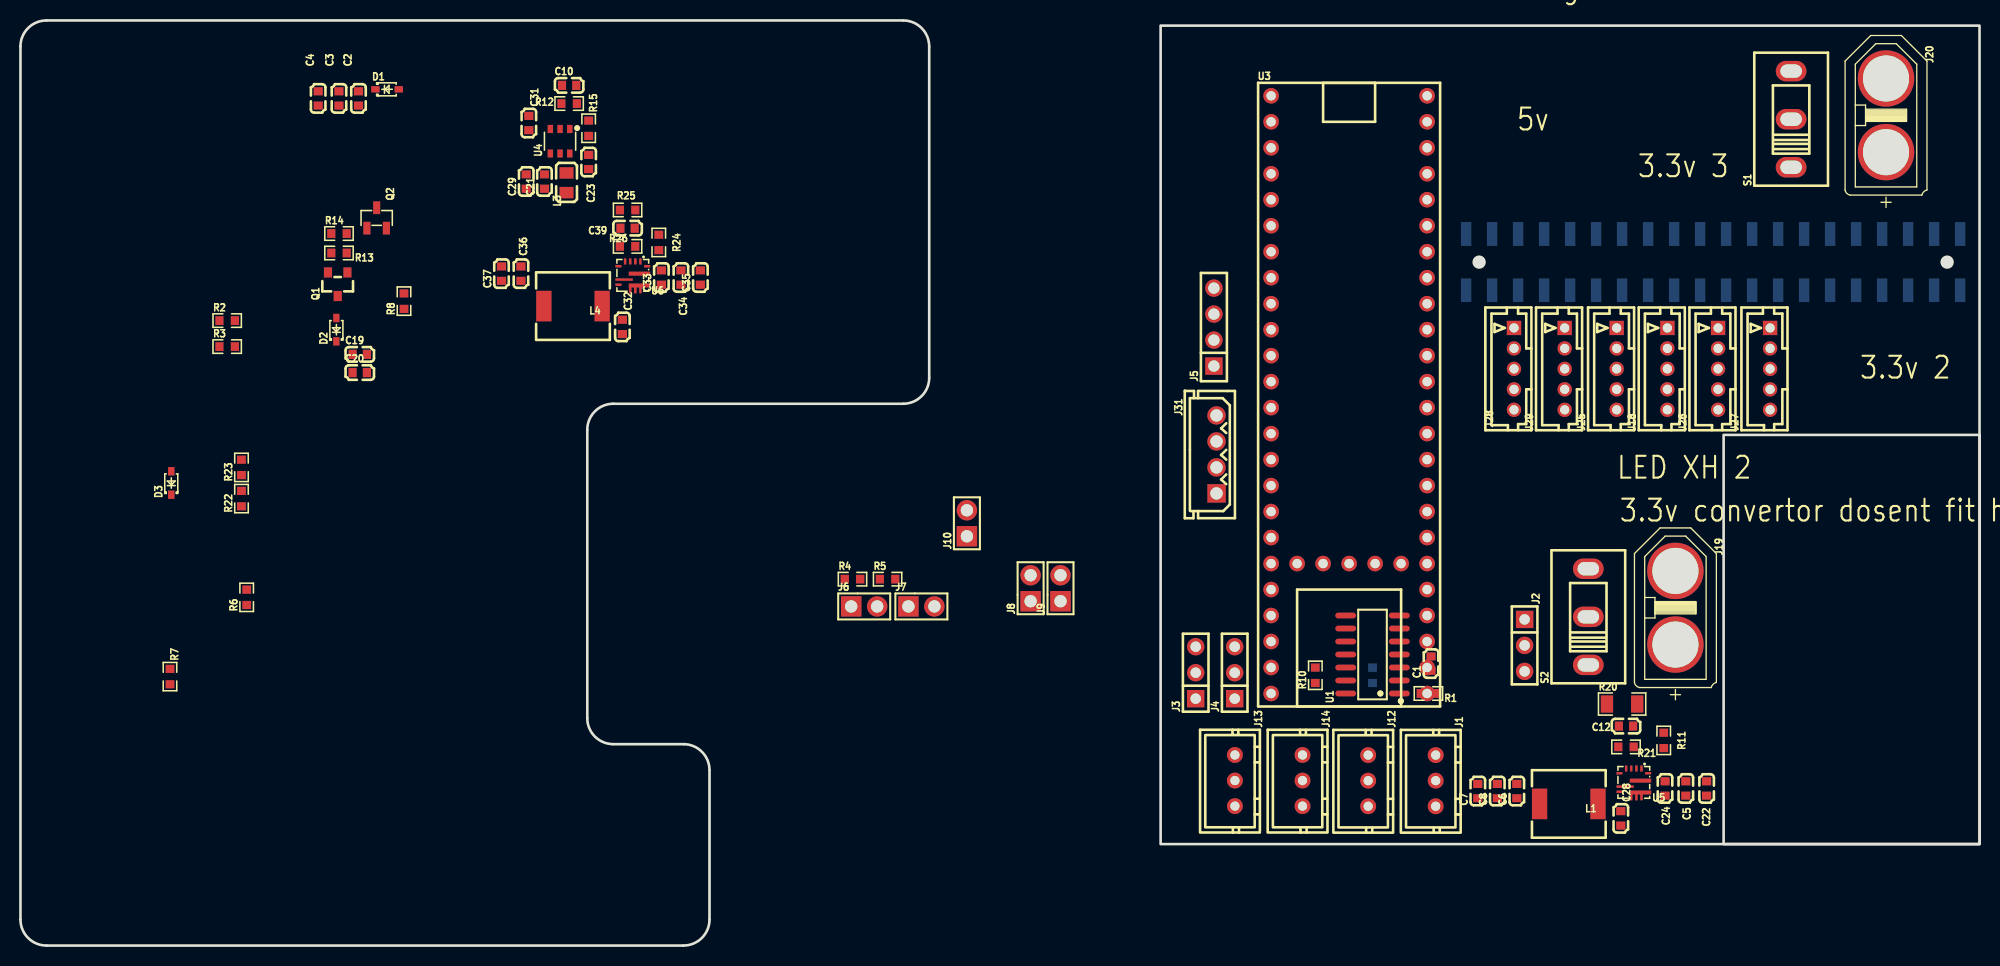
[diagram p1: board, top side]
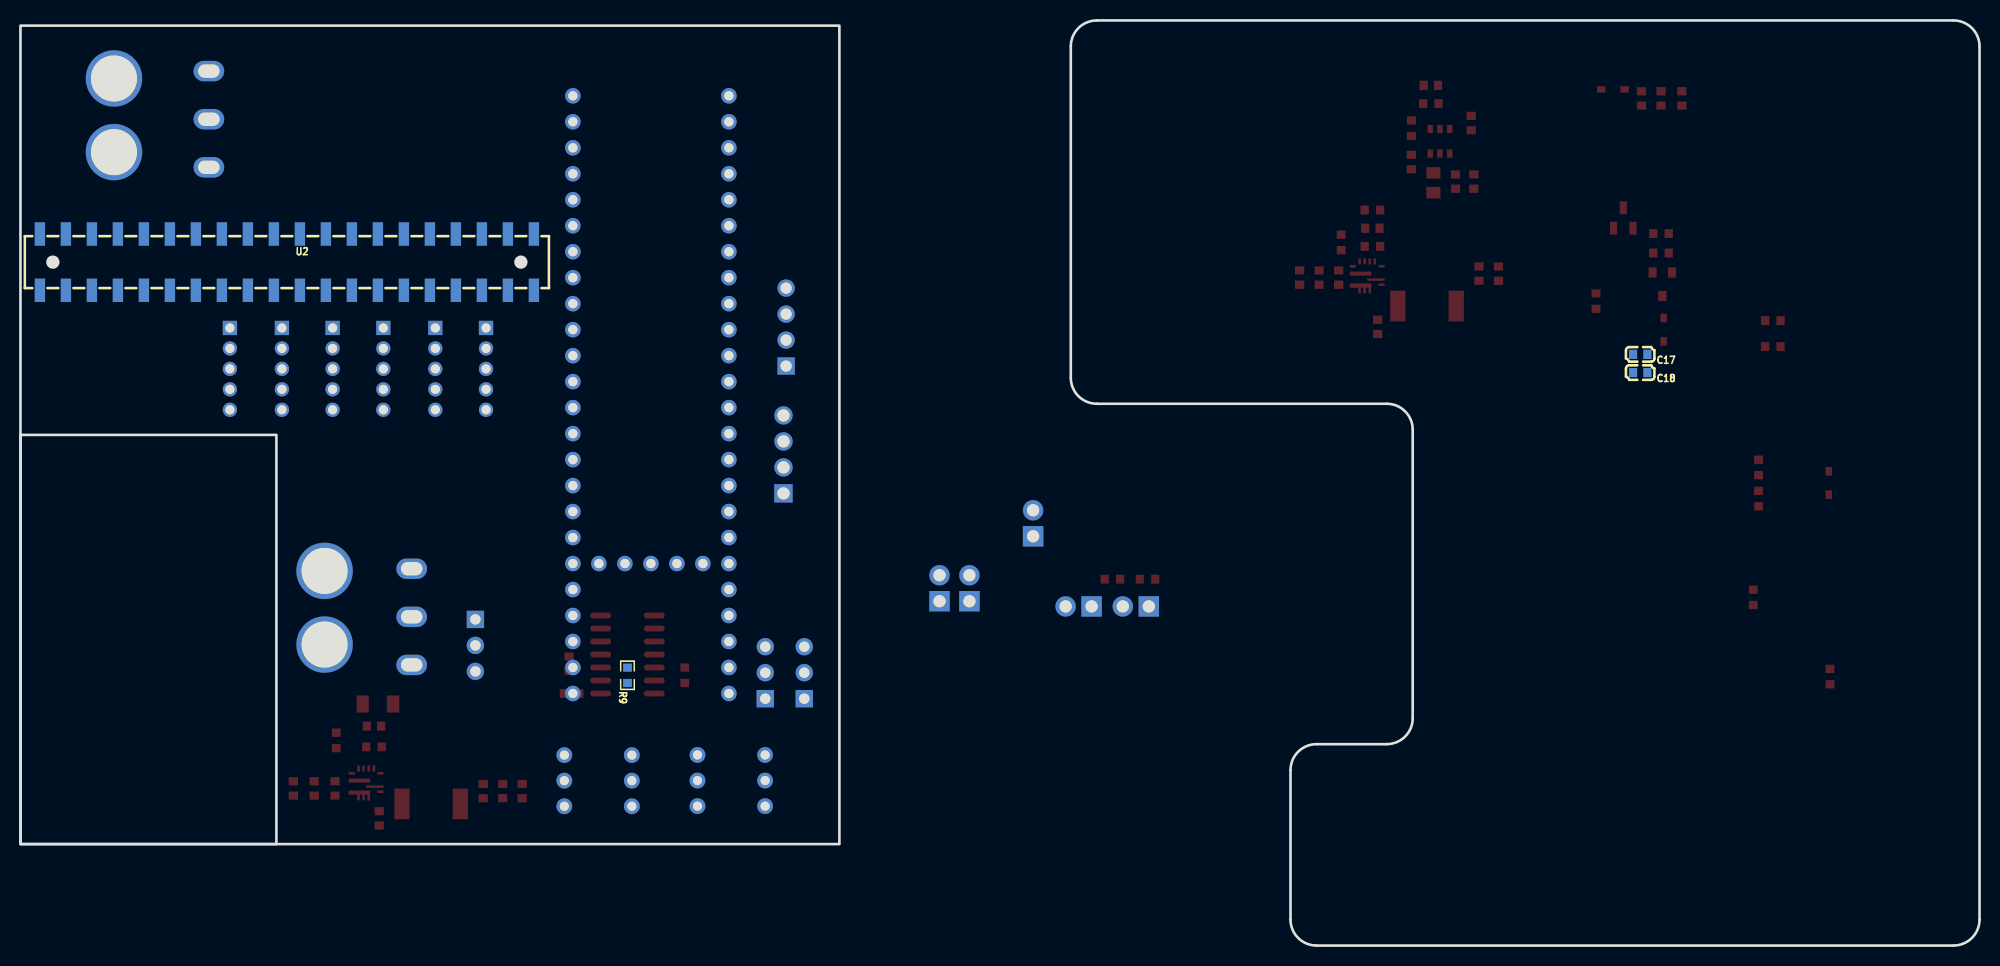
[diagram p2: board, bottom side, seen from below]

Outline 191.38 x 90.42 mm; copper layers: Top Layer, Bottom Layer. Coordinates in mm from the lower left corner of the outline.
Outline path: rectangle 111.38,89.92 191.38,9.92 ; rectangle 166.38,49.92 191.38,9.92 ; 0,87.88 arc(0.74,89.68) 2.54,90.42 86.23,90.42 arc(88.03,89.68) 88.77,87.88 88.77,55.5 arc(88.03,53.7) 86.23,52.96 57.91,52.96 arc(56.12,52.22) 55.37,50.42 55.37,22.22 arc(56.12,20.43) 57.91,19.68 64.77,19.68 arc(66.57,18.94) 67.31,17.14 67.31,2.54 arc(66.57,0.74) 64.77,0 2.54,0 arc(0.74,0.74) 0,2.54 0,87.88
Stack: Top Layer 0.035mm / Dielectric1 1.51mm FR4 er 4.5 / Bottom Layer 0.035mm

## Design rules (mm)
template: JLCPCB Capability(Two Layers Board)
spacing copperThickness1oz (default): track to track 0.102, other pairs 0.152 to 0.3
spacing copperThickness2oz: track to track 0.203, other pairs 0.152 to 0.3
track width copperThickness1oz (default): min 0.127, default 0.254, max 2.54
track width copperThickness2oz: min 0.203, default 0.254, max 2.54
differential pair differentialPair (default): width min 0.127, default 0.254, max 2.54; gap min 0.152, default 0.152
via viaSize (default): diameter min 0.5, default 0.61, max 10; hole min 0.3, default 0.305, max 6.3

## Placement (name value [footprint] x y rotation side)
C1  100nF  [C0603]  137.8 27.56 90 top
C2  22uF  [C0603]  33.02 82.8 270 top
C3  1uF  [C0603]  31.12 82.8 270 top
C4  100nF  [C0603]  29.08 82.8 270 top
C5  10uF  [C0603]  162.69 15.35 90 top
C6  22uF  [C0603]  146.18 15.1 90 top
C7  22uF  [C0603]  142.37 15.1 90 top
C8  22uF  [C0603]  144.27 15.1 90 top
C10  100pF  [C0603]  53.6 84.08 0 top
C12  150pF  [C0603]  156.84 21.45 0 top
C17  100nF  [C0603]  33.15 57.78 0 bottom
C18  1uF  [C0603]  33.15 56.01 0 bottom
C19  22uF  [C0603]  33.15 57.78 0 top
C20  47uF  [C0603]  33.15 56.01 0 top
C21  22uF  [C0603]  51.19 74.68 90 top
C22  10uF  [C0603]  164.72 15.35 90 top
C23  100nF  [C0603]  55.51 76.59 90 top
C24  100nF  [C0603]  160.66 15.35 90 top
C28  100nF  [C0603]  156.34 12.43 270 top
C29  22uF  [C0603]  49.41 74.68 90 top
C31  10uF  [C0603]  49.66 80.4 270 top
C32  100nF  [C0603]  58.8 60.47 270 top
C33  100nF  [C0603]  62.61 65.3 90 top
C34  10uF  [C0603]  64.52 65.3 90 top
C35  10uF  [C0603]  66.42 65.3 90 top
C36  22uF  [C0603]  48.9 65.68 90 top
C37  22uF  [C0603]  46.99 65.68 90 top
C39  150pF  [C0603]  59.31 70.12 0 top
D1  BAT60B  [SOD-323_L1.7-W1.3-LS2.6-RD-1]  35.81 83.69 0 top
D2  BAT60B  [SOD-323_L1.7-W1.3-LS2.6-RD-1]  30.86 60.2 90 top
D3  BAT60B  [SOD-323_L1.7-W1.3-LS2.6-RD-1]  14.73 45.21 90 top
J1  B3B-XH-A(LF)(SN)  [CONN-TH_3P-P2.50_A2501WV2-3P]  138.25 16.11 270 top
J2  PZ254V-11-03P  [HDR-TH_3P-P2.54-V-M_PZ254V-11-03P]  146.94 29.34 270 top
J3  PZ254V-11-03P  [HDR-TH_3P-P2.54-V-M_PZ254V-11-03P]  114.81 26.67 90 top
J4  PZ254V-11-03P  [HDR-TH_3P-P2.54-V-M_PZ254V-11-03P]  118.62 26.67 90 top
J5  2.54-1*4P母  [HDR-TH_4P-P2.54-V-F]  116.59 60.45 90 top
J6  PZ254V-11-02P  [HDR-TH_2P-P2.54-V-M]  82.42 33.15 0 top
J7  PZ254V-11-02P  [HDR-TH_2P-P2.54-V-M]  88.01 33.15 0 top
J8  PZ254V-11-02P  [HDR-TH_2P-P2.54-V-M]  98.68 34.92 90 top
J9  PZ254V-11-02P  [HDR-TH_2P-P2.54-V-M]  101.6 34.92 90 top
J10  PZ254V-11-02P  [HDR-TH_2P-P2.54-V-M]  92.46 41.27 90 top
J12  B3B-XH-A(LF)(SN)  [CONN-TH_3P-P2.50_A2501WV2-3P]  131.66 16.11 270 top
J13  B3B-XH-A(LF)(SN)  [CONN-TH_3P-P2.50_A2501WV2-3P]  118.64 16.13 270 top
J14  B3B-XH-A(LF)(SN)  [CONN-TH_3P-P2.50_A2501WV2-3P]  125.24 16.13 270 top
J18  B5B-PH-K-S(LF)(SN)  [CONN-TH_B5B-PH-K-S-LF-SN]  160.89 56.37 90 top
J19  XT60-F  [CONN-TH_XT60PB-F]  161.67 33.02 270 top
J20  XT60-F  [CONN-TH_XT60PB-F]  182.25 81.15 270 top
J25  B5B-PH-K-S(LF)(SN)  [CONN-TH_B5B-PH-K-S-LF-SN]  155.93 56.37 90 top
J26  B5B-PH-K-S(LF)(SN)  [CONN-TH_B5B-PH-K-S-LF-SN]  165.84 56.37 90 top
J27  B5B-PH-K-S(LF)(SN)  [CONN-TH_B5B-PH-K-S-LF-SN]  170.92 56.37 90 top
J28  B5B-PH-K-S(LF)(SN)  [CONN-TH_B5B-PH-K-S-LF-SN]  145.9 56.37 90 top
J29  B5B-PH-K-S(LF)(SN)  [CONN-TH_B5B-PH-K-S-LF-SN]  150.85 56.37 90 top
J31  22035045  [CONN-TH_22035045]  116.84 48.01 270 top
L1  3.3uH  [IND-SMD_CYA0650-3.3UH]  151.26 13.84 180 top
L3  6.8uH  [L0805]  53.35 74.55 270 top
L4  3.3uH  [IND-SMD_CYA0650-3.3UH]  53.98 62.5 180 top
Q1  AO3401A  [SOT-23_L2.9-W1.3-P1.90-LS2.4-BR]  30.99 64.64 90 top
Q2  SS8050(RANGE:200-350)  [SOT-23-3_L2.9-W1.3-P1.90-LS2.4-BR]  34.8 71.12 270 top
R1  10kΩ  [R0603]  137.54 24.64 180 top
R2  4.7kΩ  [R0603]  20.19 61.09 0 top
R3  4.7kΩ  [R0603]  20.19 58.55 0 top
R4  470Ω  [R0603]  81.28 35.81 0 top
R5  470Ω  [R0603]  84.71 35.81 0 top
R6  470Ω  [R0603]  22.1 34.04 90 top
R7  470Ω  [R0603]  14.6 26.29 270 top
R8  1kΩ  [R0603]  37.46 62.99 90 top
R9  2.2kΩ  [R0603]  132.08 26.42 90 bottom
R10  2.2kΩ  [R0603]  126.49 26.42 90 top
R11  52.3kΩ  [R0603]  160.53 20.05 90 top
R12  196kΩ  [R0603]  53.6 82.3 0 top
R13  1kΩ  [R0603]  31.12 67.69 180 top
R14  1kΩ  [R0603]  31.12 69.6 0 top
R15  62kΩ  [R0603]  55.51 79.89 270 top
R20  90kΩ  [R1206]  156.46 23.61 0 top
R21  10kΩ  [R0603]  156.84 19.42 180 top
R22  80kΩ  [R0603]  21.59 43.69 90 top
R23  20kΩ  [R0603]  21.59 46.74 90 top
R24  52.3kΩ  [R0603]  62.36 68.72 90 top
R25  73.2kΩ  [R0603]  59.31 71.9 0 top
R26  10kΩ  [R0603]  59.31 68.34 180 top
S1  SS-12M11G4  [SW-TH_XKB_SS-12M11XX]  172.97 80.77 90 top
S2  SS-12M11G4  [SW-TH_XKB_SS-12M11XX]  153.16 32.13 90 top
U1  DM74LS126AM  [SOIC-14_L8.7-W3.9-P1.27-LS6.0-BL]  132.08 28.45 90 top
U2  FH-00148  [HDR-SMD_40P-P2.54-V-F-R2-C20-S7.1-EH]  165.35 66.8 0 bottom
U3  -  [TEENSY 4.1]  129.79 52.7 0 top
U4  AP63201WU-7  [TSOT-23-6_L2.9-W1.6-P0.95-LS2.8-BR]  52.71 78.62 90 top
U5  TPS56A37RPAR  [VQFN-HR-10_L3.0-W3.0_TI_RPA]  157.61 15.99 180 top
U6  TPS56A37RPAR  [VQFN-HR-10_L3.0-W3.0_TI_RPA]  59.82 65.55 180 top

## Footprints (pads in the part's own frame, mm; a bottom-side part is the same pattern mirrored in y, then rotated)
C0603
  rect 0.8x0.9 smd: 1(-0.7,0) 2(0.7,0)
CONN-TH_3P-P2.50_A2501WV2-3P
  round 1.55 hole 0.9: 1(-2.5,0) 2(0,0) 3(2.5,0)
CONN-TH_22035045
  rect 1.8x1.8 hole 1.2: 1(3.81,0)
  round 1.8 hole 1.2: 2(1.27,0) 3(-1.27,0) 4(-3.81,0)
CONN-TH_B5B-PH-K-S-LF-SN
  rect 1.4x1.4 hole 0.9: 1(4,0)
  round 1.4 hole 0.9: 2(2,0) 3(0,0) 4(-2,0) 5(-4,0)
CONN-TH_XT60PB-F
  round 5.516 hole 4.505x4.5: +(3.6,0) -(-3.6,0)
HDR-SMD_40P-P2.54-V-F-R2-C20-S7.1-EH
  rect 1.02x2.3 smd: 1(-24.13,-2.75) 2(-24.13,2.75) 3(-21.59,-2.75) 4(-21.59,2.75) 5(-19.05,-2.75) 6(-19.05,2.75) 7(-16.51,-2.75) 8(-16.51,2.75) 9(-13.97,-2.75) 10(-13.97,2.75) 11(-11.43,-2.75) 12(-11.43,2.75) 13(-8.89,-2.75) 14(-8.89,2.75) 15(-6.35,-2.75) 16(-6.35,2.75) 17(-3.81,-2.75) 18(-3.81,2.75) 19(-1.27,-2.75) 20(-1.27,2.75) 21(1.27,-2.75) 22(1.27,2.75) 23(3.81,-2.75) 24(3.81,2.75) 25(6.35,-2.75) 26(6.35,2.75) 27(8.89,-2.75) 28(8.89,2.75) 29(11.43,-2.75) 30(11.43,2.75) 31(13.97,-2.75) 32(13.97,2.75) 33(16.51,-2.75) 34(16.51,2.75) 35(19.05,-2.75) 36(19.05,2.75) 37(21.59,-2.75) 38(21.59,2.75) 39(24.13,-2.75) 40(24.13,2.75)
HDR-TH_2P-P2.54-V-M
  rect 2x2 hole 1.2: 1(-1.27,0)
  round 2 hole 1.2: 2(1.27,0)
HDR-TH_3P-P2.54-V-M_PZ254V-11-03P
  rect 1.7x1.7 hole 1.02: 1(-2.54,0)
  round 1.7 hole 1.02: 2(0,0) 3(2.54,0)
HDR-TH_4P-P2.54-V-F
  rect 1.7x1.7 hole 1.1: 1(-3.81,0)
  round 1.7 hole 1.1: 2(-1.27,0) 3(1.27,0) 4(3.81,0)
IND-SMD_CYA0650-3.3UH
  rect 1.5x3 smd: 1(-2.85,0) 2(2.85,0)
L0805
  rect 1.133x1.377 smd: 1(-0.966,0) 2(0.966,0)
R0603
  rect 0.806x0.864 smd: 1(-0.753,0) 2(0.753,0)
R1206
  rect 1.208x1.701 smd: 1(-1.479,0) 2(1.479,0)
SOD-323_L1.7-W1.3-LS2.6-RD-1
  rect 0.83x0.63 smd: 1(-1.14,0) 2(1.14,0)
SOIC-14_L8.7-W3.9-P1.27-LS6.0-BL
  oval 0.574x2.038 smd: 1(-3.81,-2.619) 2(-2.54,-2.619) 3(-1.27,-2.619) 4(0,-2.619) 5(1.27,-2.619) 6(2.54,-2.619) 7(3.81,-2.619) 8(3.81,2.619) 9(2.54,2.619) 10(1.27,2.619) 11(0,2.619) 12(-1.27,2.619) 13(-2.54,2.619) 14(-3.81,2.619)
SOT-23-3_L2.9-W1.3-P1.90-LS2.4-BR
  rect 1.25x0.7 smd: 1(1,-0.95) 2(1,0.95) 3(-1,0)
SOT-23_L2.9-W1.3-P1.90-LS2.4-BR
  rect 1x0.8 smd: 1(1.15,-0.95) 2(1.15,0.95) 3(-1.15,0)
SW-TH_XKB_SS-12M11XX
  oval 2x3 hole 1.3x2.1: 1(-4.7,0) 2(0,0) 3(4.7,0)
TEENSY 4.1
  round 1.524 hole 0.914: 1(-7.62,30.353) 2(-7.62,27.813) 3(-7.62,25.273) 4(-7.62,22.733) 5(-7.62,20.193) 6(-7.62,17.653) 7(-7.62,15.113) 8(-7.62,12.573) 9(-7.62,10.033) 10(-7.62,7.493) 11(-7.62,4.953) 12(-7.62,2.413) 13(-7.62,-0.127) 14(-7.62,-2.667) 15(-7.62,-5.207) 16(-7.62,-7.747) 17(-7.62,-10.287) 18(-7.62,-12.827) 19(-7.62,-15.367) 20(-7.62,-17.907) 21(-7.62,-20.447) 22(-7.62,-22.987) 23(-7.62,-25.527) 24(-7.62,-28.067) 25(7.62,30.353) 26(7.62,27.813) 27(7.62,25.273) 28(7.62,22.733) 29(7.62,20.193) 30(7.62,17.653) 31(7.62,15.113) 32(7.62,12.573) 33(7.62,10.033) 34(7.62,7.493) 35(7.62,4.953) 36(7.62,2.413) 37(7.62,-0.127) 38(7.62,-2.667) 39(7.62,-5.207) 40(7.62,-7.747) 41(7.62,-10.287) 42(7.62,-12.827) 43(7.62,-15.367) 44(7.62,-17.907) 45(7.62,-20.447) 46(7.62,-22.987) 47(7.62,-25.527) 48(7.62,-28.067) 49(5.08,-15.367) 50(2.54,-15.367) 51(0,-15.367) 52(-2.54,-15.367) 53(-5.08,-15.367)
TSOT-23-6_L2.9-W1.6-P0.95-LS2.8-BR
  rect 0.8x0.532 smd: 1(1.2,-0.95) 2(1.2,0) 3(1.2,0.95) 4(-1.2,0.95) 5(-1.2,0) 6(-1.2,-0.95)
VQFN-HR-10_L3.0-W3.0_TI_RPA
  rect 0.25x0.6 smd: 1(-0.75,-1.317) 2(-0.25,-1.317) 3(0.25,-1.317) 4(0.75,-1.317)
  rect 0.6x0.25 smd: 5(1.4,-0.848) 7(1.4,0.953) 10(-1.4,-0.848)
  rect 1.7x0.25 smd: 6(0.85,0.453)
  custom 2.1x0.97 smd: 8(-0.65,1.317)
  rect 2.1x0.4 smd: 9(-0.65,-0.128)

## Nets
As in the schematic.

Pads without a net: S1 3; S2 3; U2 1 8 10 11 12 13 15 16 17 18 19 21 22 23 24 26 27 28 29 31 32 33 35 36 37 38 40; U3 4 7 8 14 15 16 17 18 19 23 27 28 29 30 36 38 39 46 47 49 50 52 53; U5 4 5; U6 4 5

## Text on the board
Top Silkscreen Layer: if this works we can use through hole for k230 as well | XT60 connector we order would be like this / https://www.amazon.ca/RIIEYOCA-Connector-Extension-Quadcopter-XT60-male/dp/B09L62W679/ref=asc_df_B09L62W679?mcid=5ea187ce5ddb3fdd8b7d2b90c9799982&tag=googleshopc0c-20&linkCode=df0&hvadid=706743214245&hvpos=&hvnetw=g&hvrand=18416964478274017855&hvpone=&hvptwo=&hvqmt=&hvdev=c&hvdvcmdl=&hvlocint=&hvlocphy=9191846&hvtargid=pla-1730363463987&hvocijid=18416964478274017855-B09L62W679-&hvexpln=0&gad_source=1&th=1 | J5 -> XH / J6~J10 -> XH 2pin, and you can utilize bottom layer as well / lets try to follow the regulator pcb design as close to instructed | 5v | LED XH 2 | 3.3v convertor dosent fit here then place at 2 or 3 | 3.3v 3 | 3.3v 2
